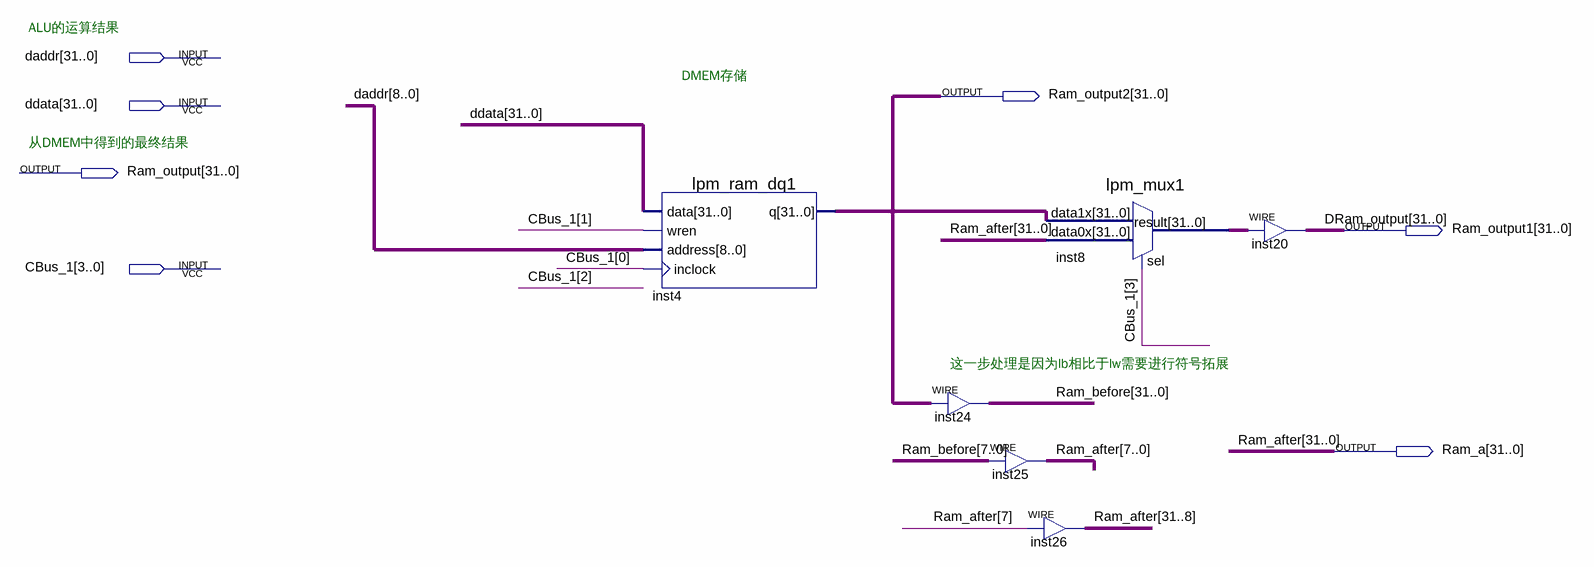
[diagram p0: schematic sheet]
// Quartus schematic DMEM.bdf as structural Verilog: 6 symbols, 7 pins
module DMEM (
  input  [31:0] daddr,
  input  [31:0] ddata,
  input  [3:0] CBus_1,
  output [31:0] Ram_output2,
  output [31:0] Ram_output,
  output [31:0] Ram_output1,
  output [31:0] Ram_a
);

  wire [31:0] inst8_result, Ram_before;

  lpm_ram_dq1 inst4 (.data(ddata), .wren(CBus_1[1]), .address(daddr[8:0]), .inclock(CBus_1[0]), .q(Ram_output2));
  assign Ram_before = Ram_output2;  // WIRE inst24
  assign Ram_a[7:0] = Ram_before[7:0];  // WIRE inst25
  lpm_mux1 inst8 (.data1x(Ram_output2), .data0x(Ram_a), .sel(CBus_1[3]), .result(inst8_result));
  assign Ram_a[31:8] = {24{Ram_a[7]}};  // WIRE inst26
  assign Ram_output1 = inst8_result;  // WIRE inst20

  // Other names for the same wires on the sheet: DRam_output[31:0] = Ram_output1; Ram_after[31:0] = Ram_a

  // Notes on the sheet:
  //   ALU的运算结果
  //   DMEM存储
  //   从DMEM中得到的最终结果
  //   这一步处理是因为lb相比于lw需要进行符号拓展
endmodule
